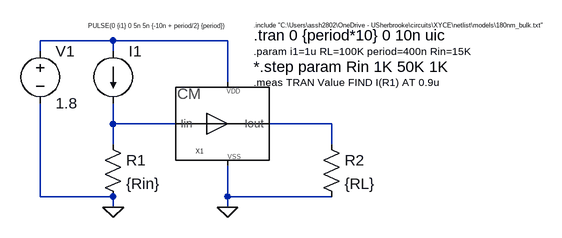
[diagram p0: schematic Test_CM.asc]
Test_CM.asc, the LTspice schematic file:
Version 4
SHEET 1 880 680
WIRE 16 64 -96 64
WIRE 192 64 16 64
WIRE -96 80 -96 64
WIRE 16 80 16 64
WIRE 192 128 192 64
WIRE 16 192 16 160
WIRE 112 192 16 192
WIRE 352 192 256 192
WIRE 16 224 16 192
WIRE 352 224 352 192
WIRE -96 304 -96 160
WIRE 16 304 -96 304
WIRE 192 304 192 256
WIRE 352 304 192 304
WIRE 16 320 16 304
WIRE 192 320 192 304
FLAG 16 320 0
FLAG 192 320 0
SYMBOL CurrentMirror 176 192 R0
SYMATTR InstName X1
SYMBOL current 16 80 R0
WINDOW 3 -38 -39 Left 0
SYMATTR InstName I1
SYMATTR Value PULSE(0 {i1} 0 5n 5n {-10n + period/2} {period})
SYMBOL res 0 208 R0
SYMATTR InstName R1
SYMATTR Value {Rin}
SYMBOL res 336 208 R0
SYMATTR InstName R2
SYMATTR Value {RL}
SYMBOL voltage -96 64 R0
WINDOW 123 0 0 Left 0
WINDOW 39 0 0 Left 0
SYMATTR InstName V1
SYMATTR Value 1.8
TEXT 232 56 Left 2 !.tran 0 {period*10} 0 10n uic
TEXT 232 80 Left 1 !.param i1=1u RL=100K period=400n Rin=15K
TEXT 232 40 Left 0 !.include "C:\\Users\\assh2802\\OneDrive - USherbrooke\\circuits\\XYCE\\netlist\\models\\180nm_bulk.txt"
TEXT 232 104 Left 2 !*.step param Rin 1K 50K 1K
TEXT 232 128 Left 1 !.meas TRAN Value FIND I(R1) AT 0.9u

The netlist it stands for:
* Test_CM.asc
XX1 N002 N003 N001 0 CurrentMirror  ; pins Iin Iout VDD VSS
I1 N001 N002 PULSE(0 {i1} 0 5n 5n {-10n + period/2} {period})
R1 N002 0 {Rin}
R2 N003 0 {RL}
V1 N001 0 1.8
.tran 0 {period*10} 0 10n uic
.param i1=1u RL=100K period=400n Rin=15K
.include "C:\Users\assh2802\OneDrive - USherbrooke\circuits\XYCE\netlist\models\180nm_bulk.txt"
*.step param Rin 1K 50K 1K
.meas TRAN Value FIND I(R1) AT 0.9u
.backanno
.end